# Altium project esp32-gps-collar.PrjPcb (part 2 of 2)

## Sheet 04-SENSORS.SchDoc
size A4; DocumentNumber: 4; SheetNumber: 4; SheetTotal: 8
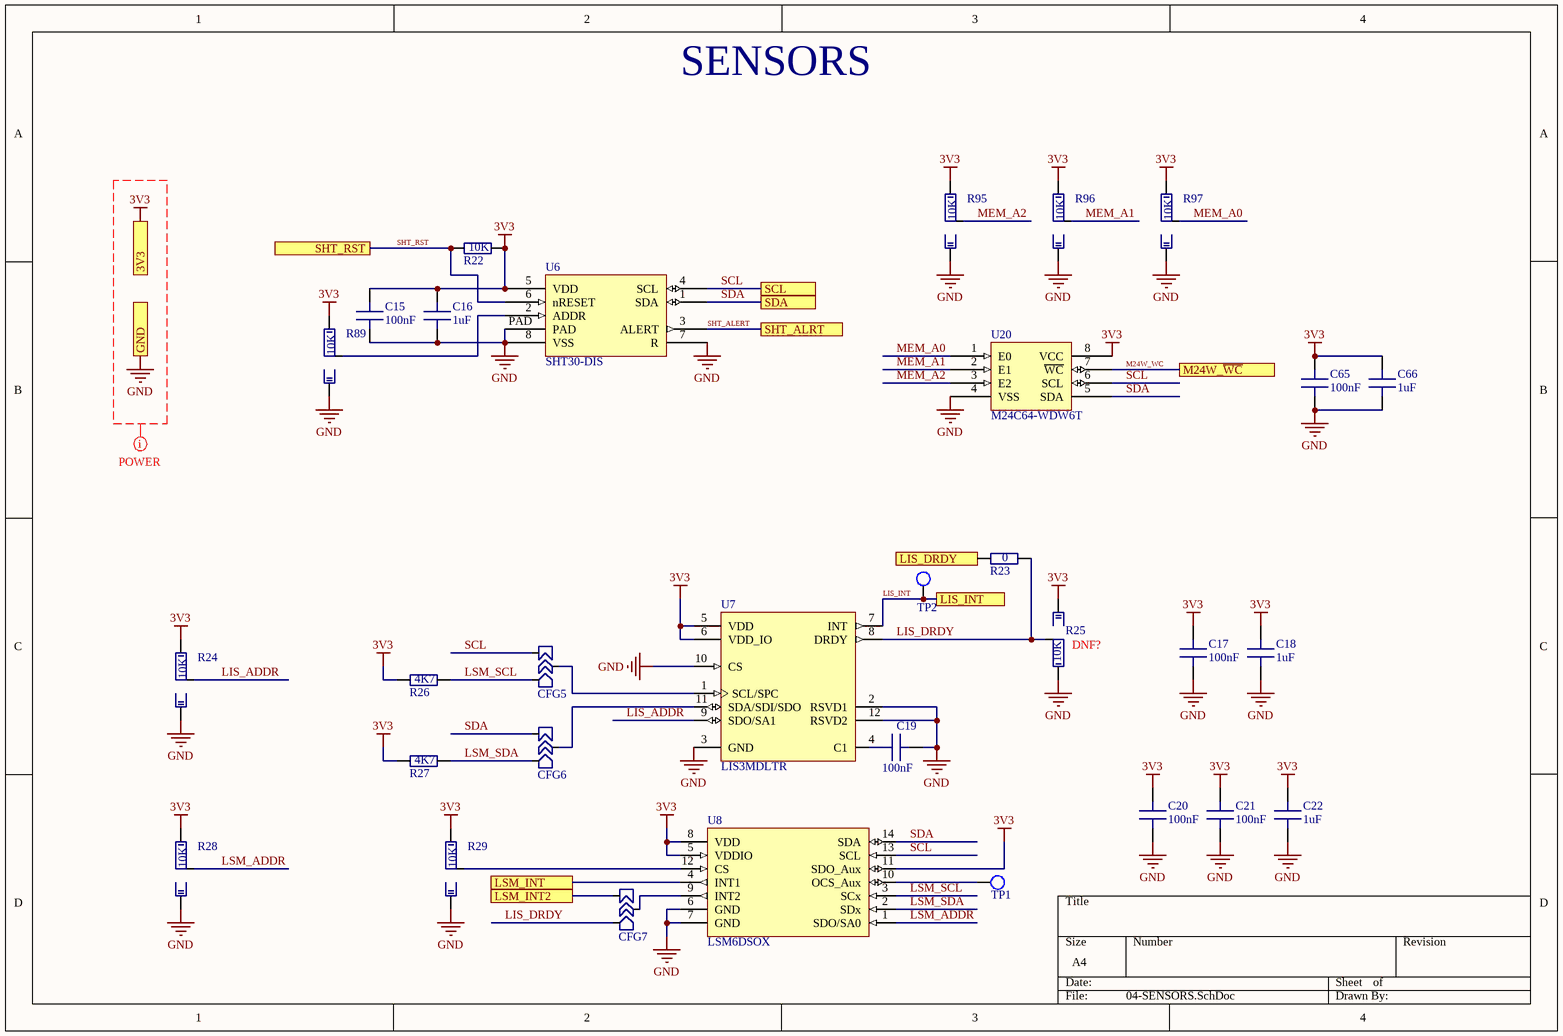
[diagram p7: 04-SENSORS.SchDoc]

### Parts
C15  100nF  [C0603]
C16  1uF  [C0805]
C17  100nF  [C0603]
C18  1uF  [C0805]
C19  100nF  [C0603]
C20  100nF  [C0603]
C21  100nF  [C0603]
C22  1uF  [C0805]
C65  100nF  [C0603]
C66  1uF  [C0805]
CFG5  CFG3_ORTH  [CFG_0603]  (value not drawn)  (no BOM)
CFG6  CFG3_ORTH  [CFG_0603]  (value not drawn)  (no BOM)
CFG7  CFG3_ORTH  [CFG_0603]  (value not drawn)  (no BOM)
R22  Resistance: 10K  [R0603]
R23  Resistance: 0  [R0603]
R24  Resistance: 10K  [RJ0603]
R25  Resistance: 10K  [RJ0603]
R26  Resistance: 4K7  [R0603]
R27  Resistance: 4K7  [R0603]
R28  Resistance: 10K  [RJ0603]
R29  Resistance: 10K  [RJ0603]
R89  Resistance: 10K  [RJ0603]
R95  Resistance: 10K  [RJ0603]
R96  Resistance: 10K  [RJ0603]
R97  Resistance: 10K  [RJ0603]
TP1  TEST_POINT  [TP_1mm]  (value not drawn)  (no BOM)
TP2  TEST_POINT  [TP_1mm]  (value not drawn)  (no BOM)
U6  SHT30-DIS  [SHT3X]
U7  LIS3MDLTR  [VFLGA-12]
U8  LSM6DSOX  [LGA-14L-PQFN50P250X300X86-14N]
U20  M24C64-WDW6T  [SO-8-SOIC127P600X175-8N]

### Ports
3V3, GND, LIS_DRDY, LIS_INT, LSM_INT, LSM_INT2, M24W_~{WC}, SCL, SDA, SHT_ALRT, SHT_RST

### Nets
3V3: C15.2 C16.2 C17.2 C18.2 C20.2 C21.2 C22.2 C65.2 C66.2 R22.2 R24.1 R25.3 R26.1 R27.1 R28.1 R29.1 R89.1 R95.1 R96.1 R97.1 U6.5(VDD) U7.5(VDD) U7.6(VDD_IO) U8.5(VDDIO) U8.8(VDD) U8.11(SDO_Aux) U20.8(VCC) ; port 3V3
GND: C15.1 C16.1 C17.1 C18.1 C19.2 C20.1 C21.1 C22.1 C65.1 C66.1 R24.3 R25.1 R28.3 R29.3 R89.3 R95.3 R96.3 R97.3 U6.7(R) U6.8(VSS) U6.PAD U7.2(RSVD1) U7.3(GND) U7.10(CS) U7.12(RSVD2) U8.6(GND) U8.7(GND) U20.4(VSS) ; port GND
LIS_ADDR: R24.2 U7.9(SDO/SA1)
LIS_DRDY: CFG7.3(B) R23.2 R25.2 U7.8(DRDY)
LIS_INT: TP2.1 U7.7(INT) ; port LIS_INT
LSM_ADDR: R28.2 U8.1(SDO/SA0)
LSM_SCL: CFG5.3(B) R26.2 U8.3(SCx)
LSM_SDA: CFG6.3(B) R27.2 U8.2(SDx)
M24W_WC: U20.7(~{WC}) ; port M24W_~{WC}
MEM_A0: R97.2 U20.1(E0)
MEM_A1: R96.2 U20.2(E1)
MEM_A2: R95.2 U20.3(E2)
SCL: CFG5.1(A) U6.4(SCL) U8.13(SCL) U20.6(SCL) ; port SCL
SDA: CFG6.1(A) U6.1(SDA) U8.14(SDA) U20.5(SDA) ; port SDA
SHT_ALERT: U6.3(ALERT) ; port SHT_ALRT
SHT_RST: R22.1 U6.6(nRESET) ; port SHT_RST
NetC19_1: C19.1 U7.4(C1)
NetCFG5_2: CFG5.2(IN) U7.1(SCL/SPC)
NetCFG6_2: CFG6.2(IN) U7.11(SDA/SDI/SDO)
NetCFG7_1: CFG7.1(A) ; port LSM_INT2
NetCFG7_2: CFG7.2(IN) U8.9(INT2)
NetR23_1: R23.1 ; port LIS_DRDY
NetR29_2: R29.2 U8.12(CS)
NetR89_2: R89.2 U6.2(ADDR)
NetTP1_1: TP1.1 U8.10(OCS_Aux)
NetU8_4: U8.4(INT1) ; port LSM_INT

### Layout directives
net class POWER_NET_CLASS: 3V3, GND

### Notes on the sheet
- SENSORS
- (near R25) DNF?

### Library data of the parts
C15 C17 C19-C21 C65 = C0603_100nF_16V: Ceramic capacitor; Voltage: 16V; Capacity: 100nF; Size: 0603; Value: 100nF; PriceKosmodromUAH: 1; Kosmodrom: http://www.kosmodrom.com.ua/el.php?name=CP06030.125V8020
C16 C18 C22 C66 = C0805_1uF_25V: Ceramic capacitor; Voltage: 25V; Capacity: 1uF; Size: 0805; Value: 1uF; PriceKosmodromUAH: 1; Kosmodrom: http://www.kosmodrom.com.ua/el.php?name=CP0805125V10
R22 = R0603_10K: Resistor General; Tolerance: 5%; Owned: 3000; Size: 0603; PriceRCSUAH: 0,06; RCS: https://www.rcscomponents.kiev.ua/product/10-kohm-5-0-1w-50v-0603-rc0603jr-0710kl-yageo_107096.html
R23 = R0603_0R: Resistor General; Tolerance: *; Size: 0603; PriceRCSUAH: 0,06; RCS: https://www.rcscomponents.kiev.ua/product/0-ohm-5-0-1w-50v-0603-rc0603jr-0r-hitano-rezistor-smd_4159.html
R24 R25 R28 R29 R89 R95-R97 = RJ0603_10K: Resistor General; Tolerance: 5%; Owned: 3000; Size: 0603; RCS: https://www.rcscomponents.kiev.ua/product/10-kohm-5-0-1w-50v-0603-rc0603jr-0710kl-yageo_107096.html; PriceRCSUAH: 0,06
R26 R27 = R0603_4K7: Resistor General; Tolerance: 5%; Owned: 3000; Size: 0603
U6 = SHT30-DIS: Temp & Humidity sensor; PriceKosmodromUAH: 75,75; Kosmodrom: http://www.kosmodrom.com.ua/el.php?name=SHT30-DIS-B
U7 = LIS3MDLTR: / LIS3MDL Series 3 Axis В±2/В±8/В±12/В±16 g 3.6V High Performance Magnetometer LGA-12 /; MF: STMicroelectronics; Package: VFLGA-12 STMicroelectronics; MP: LIS3MDLTR; Availability: Unavailable; Price: None; SnapEDA_Link: https://www.snapeda.com/parts/LIS3MDLTR/STMicroelectronics/view-part/?ref=snap; Value: *; PriceKosmodromUAH: 57,5; Kosmodrom: http://www.kosmodrom.com.ua/el.php?name=LIS3MDLTR
U8 = LSM6DSOX: Gygo and acceletometer programmable I2C master IC; Owned: 10; PriceDigiKey: 5,25; PriceMouser: 4,76; DigiKey: https://www.digikey.com/product-detail/en/stmicroelectronics/LSM6DSOXTR/497-18367-1-ND/9841887; Mouser: https://www.mouser.com/ProductDetail/STMicroelectronics/LSM6DSOXTR?qs=sGAEpiMZZMve4%2FbfQkoj%252BFvk5v0Gskwou%2F%2FEWTdvAK0%3D
U20 = M24C64-WDW6T: 64Kbit Serial I2C Bus EEPROM; Kosmodrom: *http://www.kosmodrom.com.ua/el.php?name=M24C64-WMN6TP; PriceUAH: -; PriceKosmodromUAH: 5

## Sheet 06-LORA.SchDoc: LoRa
size A4; DocumentNumber: 6; SheetNumber: 6; SheetTotal: 8
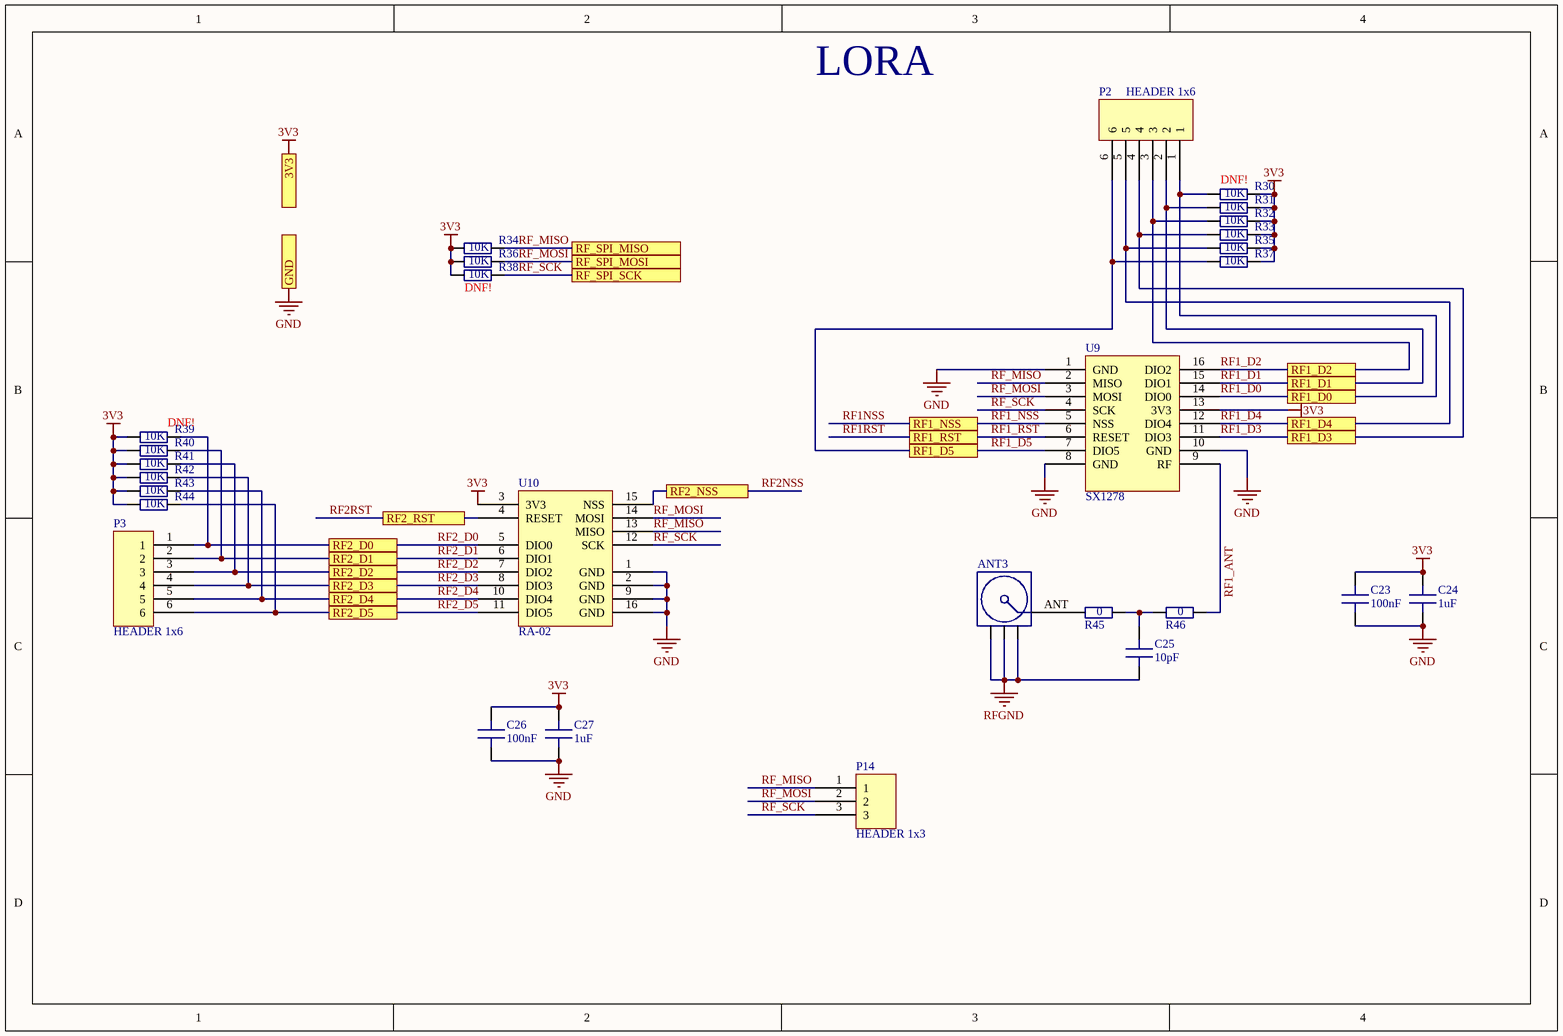
[diagram p8: 06-LORA.SchDoc]

### Parts
ANT3  UFL  [U.FL CONNECTOR]  (value not drawn)
C23  100nF  [C0603]
C24  1uF  [C0805]
C25  10pF  [C0402]
C26  100nF  [C0603]
C27  1uF  [C0805]
P2  HEADER 1x6  [HEADER 1x6 2.54]
P3  HEADER 1x6  [HEADER 1x6 2.54]
P14  HEADER 1x3  [UART_2.54]
R30  Resistance: 10K  [R0603]
R31  Resistance: 10K  [R0603]
R32  Resistance: 10K  [R0603]
R33  Resistance: 10K  [R0603]
R34  Resistance: 10K  [R0603]
R35  Resistance: 10K  [R0603]
R36  Resistance: 10K  [R0603]
R37  Resistance: 10K  [R0603]
R38  Resistance: 10K  [R0603]
R39  Resistance: 10K  [R0603]
R40  Resistance: 10K  [R0603]
R41  Resistance: 10K  [R0603]
R42  Resistance: 10K  [R0603]
R43  Resistance: 10K  [R0603]
R44  Resistance: 10K  [R0603]
R45  Resistance: 0  [R0402]
R46  Resistance: 0  [R0402]
U9  SX1278  [SX1278]
U10  RA-02  [RA-02]

### Ports
3V3 (out), GND, RF1_D0, RF1_D1, RF1_D2, RF1_D3, RF1_D4, RF1_D5, RF1_NSS, RF1_RST, RF2_D0, RF2_D1, RF2_D2, RF2_D3, RF2_D4, RF2_D5, RF2_NSS, RF2_RST, RF_SPI_MISO, RF_SPI_MOSI, RF_SPI_SCK

### Nets
3V3: C23.2 C24.2 C26.2 C27.2 R30.2 R31.2 R32.2 R33.2 R34.1 R35.2 R36.1 R37.2 R38.1 R39.1 R40.1 R41.1 R42.1 R43.1 R44.1 U9.13(3V3) U10.3(3V3) ; port 3V3
GND: C23.1 C24.1 C26.1 C27.1 U9.1(GND) U9.8(GND) U9.10(GND) U10.1(GND) U10.2(GND) U10.9(GND) U10.16(GND) ; port GND
RFGND: ANT3.GND C25.1
RF1_ANT: R46.2 U9.9(RF)
RF1_D0: P2.1 R30.1 U9.14(DIO0) ; port RF1_D0
RF1_D1: P2.2 R31.1 U9.15(DIO1) ; port RF1_D1
RF1_D2: P2.3 R32.1 U9.16(DIO2) ; port RF1_D2
RF1_D3: P2.4 R33.1 U9.11(DIO3) ; port RF1_D3
RF1_D4: P2.5 R35.1 U9.12(DIO4) ; port RF1_D4
RF1_D5: P2.6 R37.1 U9.7(DIO5) ; port RF1_D5
RF1_NSS: U9.5(NSS) ; port RF1_NSS  [also labelled RF1NSS]
RF1_RST: U9.6(RESET) ; port RF1_RST  [also labelled RF1RST]
RF2_D0: P3.1 R39.2 U10.5(DIO0) ; port RF2_D0
RF2_D1: P3.2 R40.2 U10.6(DIO1) ; port RF2_D1
RF2_D2: P3.3 R41.2 U10.7(DIO2) ; port RF2_D2
RF2_D3: P3.4 R42.2 U10.8(DIO3) ; port RF2_D3
RF2_D4: P3.5 R43.2 U10.10(DIO4) ; port RF2_D4
RF2_D5: P3.6 R44.2 U10.11(DIO5) ; port RF2_D5
RF2NSS: U10.15(NSS) ; port RF2_NSS
RF2RST: U10.4(RESET) ; port RF2_RST
RF_MISO: P14.1 R34.2 U9.2(MISO) U10.13(MISO) ; port RF_SPI_MISO
RF_MOSI: P14.2 R36.2 U9.3(MOSI) U10.14(MOSI) ; port RF_SPI_MOSI
RF_SCK: P14.3 R38.2 U9.4(SCK) U10.12(SCK) ; port RF_SPI_SCK
NetANT3_ANT: ANT3.ANT(SIGNAL) R45.1
NetC25_2: C25.2 R45.2 R46.1

### Notes on the sheet
- LORA
- (near R30) DNF!
- (near R38) DNF!
- (near R39) DNF!

### Library data of the parts
ANT3 = ANT-U.FL: Generic U.FL connector with 1 ANT + 3 GND
C23 C26 = C0603_100nF_16V: Ceramic capacitor; Voltage: 16V; Capacity: 100nF; Size: 0603; Value: 100nF
C24 C27 = C0805_1uF_25V: Ceramic capacitor; Voltage: 25V; Capacity: 1uF; Size: 0805; Value: 1uF
C25 = C0402_10pF_50V: Ceramic capacitor; Voltage: 50V; Capacity: 10pF; Size: 0402; Value: 10pF
R30-R44 = R0603_10K: Resistor General; Tolerance: 5%; Size: 0603
R45 R46 = R0402_0R: Resistor General; Tolerance: *; Size: 0402
U9 = SX1278: SX1278 LoRa modem; Value: SX1278
U10 = RA-02: RA-02 LoRa modem by Ai-Thinker; Value: RA-02

## Sheet 000-PDN.SchDoc
size A4
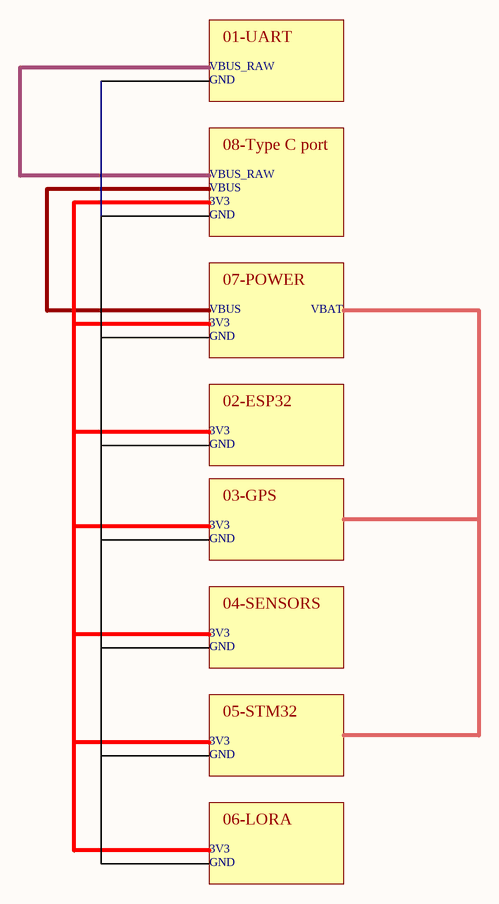
[diagram p9: 000-PDN.SchDoc]

### Notes on the sheet
- VBUS_RAW
- 01-UART
- GND
- VBUS
- 3V3
- 08-Type C port
- 07-POWER
- VBAT
- 02-ESP32
- 03-GPS
- 04-SENSORS
- 05-STM32
- 06-LORA

## Sheet Notes.SchDoc
size A4

## Nets that join several sheets
3V3: 02-ESP32 (10 pins), 05-STM32 (29 pins), 07-POWER (8 pins), 08-TYPE-C-PORT (11 pins), 03-GPS (11 pins), 04-SENSORS (27 pins), 06-LORA (21 pins)
GND: 00-OVERVIEW (14 pins), 01-UART (15 pins), 02-ESP32 (25 pins), 05-STM32 (41 pins), 07-POWER (22 pins), 08-TYPE-C-PORT (16 pins), 03-GPS (8 pins), 04-SENSORS (28 pins), 06-LORA (11 pins)
RFGND: 03-GPS (12 pins), 06-LORA (ANT3.GND C25.1)
VBUS: 07-POWER (D5.A D6.A Q3.2), 08-TYPE-C-PORT (Q6.3)
BOOT0: 02-ESP32 (J11.2), 05-STM32 (6 pins)
C_D0_N: 01-UART (R10.1), 08-TYPE-C-PORT (U13.4)
C_D0_P: 01-UART (R8.1), 08-TYPE-C-PORT (U13.6)
CHG_ENr: 05-STM32 (U17.51), 07-POWER (R102.2)
CHG_STATr: 05-STM32 (U17.61), 07-POWER (R101.1)
CPRX: 01-UART (R7.2 U2.25), 02-ESP32 (R74.1)
CPTX: 01-UART (R6.1 U2.26), 02-ESP32 (R75.1)
DTR: 01-UART (U2.28), 02-ESP32 (R77.1 VT1.4)
E_CLK: 02-ESP32 (J19.2), 05-STM32 (U17.78)
E_EN: 02-ESP32 (CFG8.3), 05-STM32 (U17.59)
E_INTI: 02-ESP32 (J22.2), 05-STM32 (U17.87)
E_INTO: 02-ESP32 (J21.2), 05-STM32 (U17.86)
E_MISO: 02-ESP32 (J20.2), 05-STM32 (U17.79)
E_MOSI: 02-ESP32 (J23.2), 05-STM32 (U17.91)
E_RX: 02-ESP32 (J17.2), 05-STM32 (U17.48)
E_TX: 02-ESP32 (J18.2), 05-STM32 (U17.47)
GPS_TX3: 05-STM32 (U17.34), 03-GPS (J6.1)
GPS_VBAT: 05-STM32 (U17.6), 07-POWER (B1.POS), 03-GPS (U3.21 U5.22)
LIS_INT: 05-STM32 (U17.85), 04-SENSORS (TP2.1 U7.7)
M24W_WC: 05-STM32 (U17.88), 04-SENSORS (U20.7)
NetCFG7_1: 05-STM32 (U17.97), 04-SENSORS (CFG7.1)
NetJ2_2: 05-STM32 (U17.25), 03-GPS (J2.2)
NetJ3_2: 05-STM32 (U17.26), 03-GPS (J3.2)
NetJ4_2: 05-STM32 (U17.69), 03-GPS (J4.2)
NetJ5_2: 05-STM32 (U17.68), 03-GPS (J5.2)
NetR12_1: 05-STM32 (U17.62), 03-GPS (R12.1 U3.10)
NetR21_1: 05-STM32 (U17.41), 03-GPS (R21.1)
NetR23_1: 05-STM32 (U17.84), 04-SENSORS (R23.1)
NetU8_4: 05-STM32 (U17.98), 04-SENSORS (U8.4)
PD_ALERT: 05-STM32 (U17.81), 08-TYPE-C-PORT (R62.1 TP23.1 U14.9)
PD_RESET: 05-STM32 (U17.57), 08-TYPE-C-PORT (R69.2 TP22.1 U14.6)
PD_SSMUX: 05-STM32 (U17.60), 08-TYPE-C-PORT (R53.1)
PD_TX_EN: 05-STM32 (U17.35), 08-TYPE-C-PORT (R70.2 TP21.1 U14.15)
PDI2C_SCL: 05-STM32 (U17.92), 08-TYPE-C-PORT (R64.1 U14.7)
PDI2C_SDA: 05-STM32 (U17.93), 08-TYPE-C-PORT (R63.1 U14.8)
PDSPI_MISO: 05-STM32 (U17.31), 08-TYPE-C-PORT (R68.1 U14.14), 03-GPS (CFG3.3)
PDSPI_MOSI: 05-STM32 (U17.32), 08-TYPE-C-PORT (R67.1 U14.11), 03-GPS (CFG4.3)
PDSPI_NSS: 05-STM32 (U17.29), 08-TYPE-C-PORT (R66.1 U14.12)
PDSPI_SCK: 05-STM32 (U17.30), 08-TYPE-C-PORT (R65.1 U14.16), 03-GPS (CFG2.3)
RF1_D0: 05-STM32 (U17.1), 06-LORA (P2.1 R30.1 U9.14)
RF1_D1: 05-STM32 (U17.2), 06-LORA (P2.2 R31.1 U9.15)
RF1_D2: 05-STM32 (U17.3), 06-LORA (P2.3 R32.1 U9.16)
RF1_D3: 05-STM32 (U17.65), 06-LORA (P2.4 R33.1 U9.11)
RF1_D4: 05-STM32 (U17.66), 06-LORA (P2.5 R35.1 U9.12)
RF1_D5: 05-STM32 (U17.67), 06-LORA (P2.6 R37.1 U9.7)
RF1_NSS: 05-STM32 (U17.45), 06-LORA (U9.5)
RF1_RST: 05-STM32 (U17.46), 06-LORA (U9.6)
RF2_D0: 05-STM32 (U17.4), 06-LORA (P3.1 R39.2 U10.5)
RF2_D1: 05-STM32 (U17.56), 06-LORA (P3.2 R40.2 U10.6)
RF2_D2: 05-STM32 (U17.55), 06-LORA (P3.3 R41.2 U10.7)
RF2_D3: 05-STM32 (U17.54), 06-LORA (P3.4 R42.2 U10.8)
RF2_D4: 05-STM32 (U17.96), 06-LORA (P3.5 R43.2 U10.10)
RF2_D5: 05-STM32 (U17.95), 06-LORA (P3.6 R44.2 U10.11)
RF2NSS: 05-STM32 (U17.43), 06-LORA (U10.15)
RF2RST: 05-STM32 (U17.44), 06-LORA (U10.4)
RF_MISO: 05-STM32 (U17.17), 06-LORA (P14.1 R34.2 U9.2 U10.13)
RF_MOSI: 05-STM32 (U17.18), 06-LORA (P14.2 R36.2 U9.3 U10.14)
RF_SCK: 05-STM32 (U17.82), 06-LORA (P14.3 R38.2 U9.4 U10.12)
RTS: 01-UART (U2.24), 02-ESP32 (R81.1 VT1.6)
SCL: 05-STM32 (D15.3 P6.2 R54.2 U17.52), 04-SENSORS (CFG5.1 U6.4 U8.13 U20.6)
SDA: 05-STM32 (D15.2 P6.3 R90.2 U17.53), 04-SENSORS (CFG6.1 U6.1 U8.14 U20.5)
SHT_ALERT: 05-STM32 (U17.37), 04-SENSORS (U6.3)
SHT_RST: 05-STM32 (U17.36), 04-SENSORS (R22.1 U6.6)
UB_~{CS}: 05-STM32 (U17.42), 03-GPS (CFG1.3)
UB_EXTI: 05-STM32 (U17.38), 03-GPS (U5.4)
UB_LNA_EN: 05-STM32 (U17.63), 03-GPS (U5.14)
UB_~{RST}: 05-STM32 (U17.40), 03-GPS (TP4.1 U5.8)
UB_RX: 05-STM32 (U17.23), 03-GPS (CFG4.1)
UB_SCL: 05-STM32 (U17.15), 03-GPS (CFG2.1)
UB_SDA: 05-STM32 (U17.16), 03-GPS (CFG1.1)
UB_TPULS: 05-STM32 (U17.39), 03-GPS (U5.3)
UB_TX: 05-STM32 (U17.24), 03-GPS (CFG3.1)
VBUS_RAW: 01-UART (C1.1 C2.2 U1.4), 08-TYPE-C-PORT (7 pins)